# Altium schematic sheet 04 DRIVER.SchDoc: DRIVER
size 420 x 297 mm; SheetNumber: 4; SheetTotal: 6
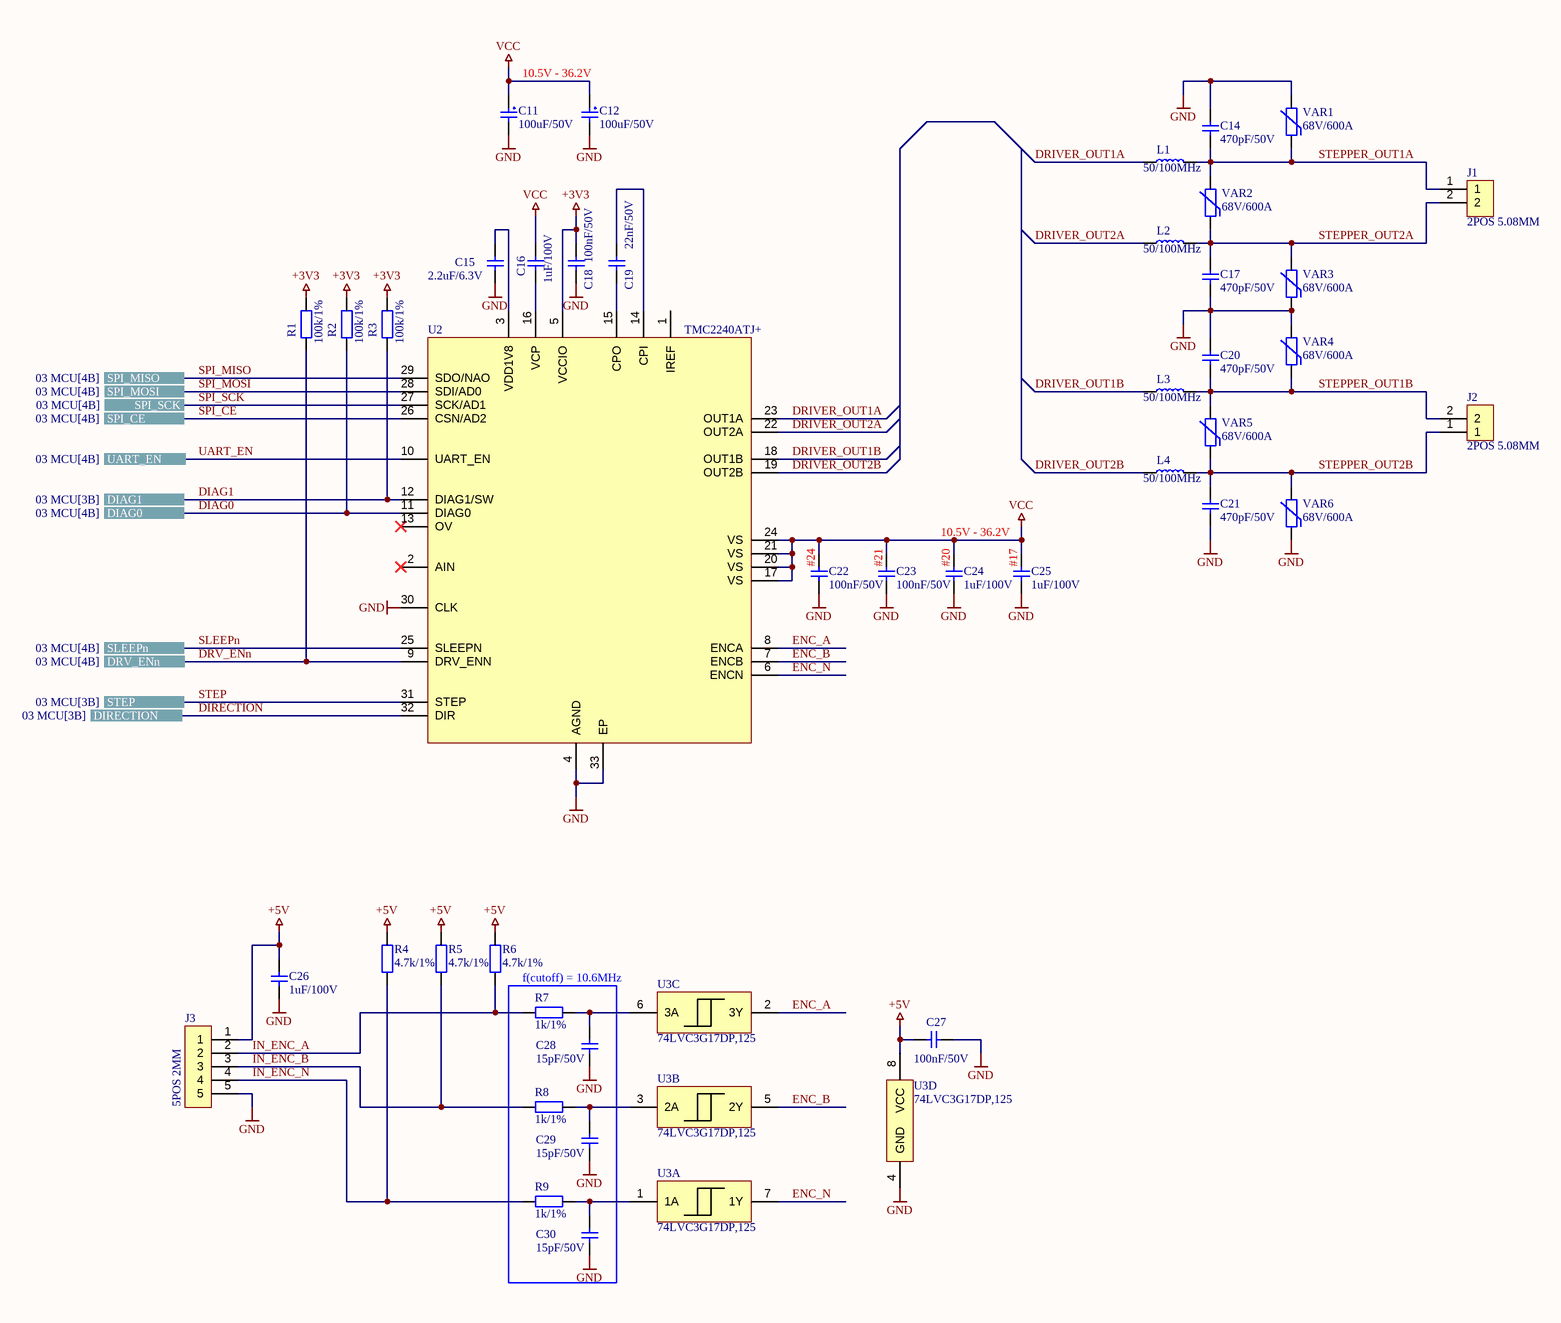
[diagram p0: 04 DRIVER.SchDoc]

## Parts
C11  100uF/50V  [A768KS107M1HLAE030]
C12  100uF/50V  [A768KS107M1HLAE030]
C14  470pF/50V  [CAPC1005X06M-0402]
C15  2.2uF/6.3V  [CAPC1005X06M-0402]
C16  1uF/100V  [CAPC2012X14M]
C17  470pF/50V  [CAPC1005X06M-0402]
C18  100nF/50V  [CAPC1005X06M-0402]
C19  22nF/50V  [CAPC1005X06M-0402]
C20  470pF/50V  [CAPC1005X06M-0402]
C21  470pF/50V  [CAPC1005X06M-0402]
C22  100nF/50V  [CAPC1005X06M-0402]
C23  100nF/50V  [CAPC1005X06M-0402]
C24  1uF/100V  [CAPC2012X14M]
C25  1uF/100V  [CAPC2012X14M]
C26  1uF/100V  [CAPC2012X14M]
C27  100nF/50V  [CAPC1005X06M-0402]
C28  15pF/50V  [CAPC1005X06M-0402]
C29  15pF/50V  [CAPC1005X06M-0402]
C30  15pF/50V  [CAPC1005X06M-0402]
J1  2POS 5.08MM  [282837-2]
J2  2POS 5.08MM  [282837-2]
J3  5POS 2MM  [B5B-PH-K-S]
L1  50/100MHz  [INDC3200X110-1206]
L2  50/100MHz  [INDC3200X110-1206]
L3  50/100MHz  [INDC3200X110-1206]
L4  50/100MHz  [INDC3200X110-1206]
R1  100k/1%  [RESC1005X04M-0402]
R2  100k/1%  [RESC1005X04M-0402]
R3  100k/1%  [RESC1005X04M-0402]
R4  4.7k/1%  [RESC1005X04M-0402]
R5  4.7k/1%  [RESC1005X04M-0402]
R6  4.7k/1%  [RESC1005X04M-0402]
R7  1k/1%  [RESC1005X04M-0402]
R8  1k/1%  [RESC1005X04M-0402]
R9  1k/1%  [RESC1005X04M-0402]
U2  TMC2240ATJ+  [TQFN32-5mmx5mm]
U3  74LVC3G17DP,125  [TSOP65P400X110-8N]  (parts A,B,C,D of 4)
VAR1  68V/600A  [VARA4732X16N]
VAR2  68V/600A  [VARA4732X16N]
VAR3  68V/600A  [VARA4732X16N]
VAR4  68V/600A  [VARA4732X16N]
VAR5  68V/600A  [VARA4732X16N]
VAR6  68V/600A  [VARA4732X16N]

## Blocks framed on the sheet
f(cutoff) = 10.6MHz: C28-C30 R7-R9

## Ports
DIAG0 (see 03 MCU[4B]), DIAG1 (see 03 MCU[3B]), DIRECTION (see 03 MCU[3B]), DRV_ENn (see 03 MCU[4B]), SLEEPn (see 03 MCU[4B]), SPI_CE (see 03 MCU[4B]), SPI_MISO (see 03 MCU[4B]), SPI_MOSI (see 03 MCU[4B]), SPI_SCK (see 03 MCU[4B]), STEP (see 03 MCU[3B]), UART_EN (see 03 MCU[4B])

## Nets
+3V3: C18.2 R1.2 R2.2 R3.2 U2.5(VCCIO)
+5V: C26.2 C27.1 J3.1 R4.2 R5.2 R6.2 U3.8(VCC)
GND: C11.2 C12.2 C14.1 C15.1 C17.2 C18.1 C20.1 C21.2 C22.1 C23.1 C24.1 C25.1 C26.1 C27.2 C28.1 C29.1 C30.1 J3.5 U2.4(AGND) U2.30(CLK) U2.33(EP) U3.4(GND) VAR1.2 VAR3.1 VAR4.2 VAR6.1
VCC: C11.1 C12.1 C16.2 C22.2 C23.2 C24.2 C25.2 U2.17(VS) U2.20(VS) U2.21(VS) U2.24(VS)
DIAG0: R2.1 U2.11(DIAG0) ; port DIAG0
DIAG1: R3.1 U2.12(DIAG1/SW) ; port DIAG1
DIRECTION: U2.32(DIR) ; port DIRECTION
DRIVER_OUT1A: L1.1 U2.23(OUT1A)
DRIVER_OUT1B: L3.1 U2.18(OUT1B)
DRIVER_OUT2A: L2.1 U2.22(OUT2A)
DRIVER_OUT2B: L4.1 U2.19(OUT2B)
DRV_ENn: R1.1 U2.9(DRV_ENN) ; port DRV_ENn
ENC_A: U2.8(ENCA) U3.2(3Y)
ENC_B: U2.7(ENCB) U3.5(2Y)
ENC_N: U2.6(ENCN) U3.7(1Y)
IN_ENC_A: J3.2 R6.1 R7.1
IN_ENC_B: J3.3 R5.1 R8.1
IN_ENC_N: J3.4 R4.1 R9.1
SLEEPn: U2.25(SLEEPN) ; port SLEEPn
SPI_CE: U2.26(CSN/AD2) ; port SPI_CE
SPI_MISO: U2.29(SDO/NAO) ; port SPI_MISO
SPI_MOSI: U2.28(SDI/AD0) ; port SPI_MOSI
SPI_SCK: U2.27(SCK/AD1) ; port SPI_SCK
STEP: U2.31(STEP) ; port STEP
STEPPER_OUT1A: C14.2 J1.1 L1.2 VAR1.1 VAR2.2
STEPPER_OUT1B: C20.2 J2.2 L3.2 VAR4.1 VAR5.2
STEPPER_OUT2A: C17.1 J1.2 L2.2 VAR2.1 VAR3.2
STEPPER_OUT2B: C21.1 J2.1 L4.2 VAR5.1 VAR6.2
UART_EN: U2.10(UART_EN) ; port UART_EN
NetC15_2: C15.2 U2.3(VDD1V8)
NetC16_1: C16.1 U2.16(VCP)
NetC19_1: C19.1 U2.15(CPO)
NetC19_2: C19.2 U2.14(CPI)
NetC28_2: C28.2 R7.2 U3.6(3A)
NetC29_2: C29.2 R8.2 U3.3(2A)
NetC30_2: C30.2 R9.2 U3.1(1A)

Not connected (* = marked no-connect by the designer): U2 1(IREF) 2(AIN)* 13(OV)*

## Notes on the sheet
- 10.5V - 36.2V
- (near C22) #24
- (near C23) #21
- (near C24) #20
- (near C25) #17
- Title
- Project
- Size
- Date
- Revision
- A3
- Designed By

## Library data of the parts
C11 C12 = A768KS107M1HLAE030: 100 µF 50 V Aluminum - Polymer Capacitors Radial, Can - SMD 30mOhm 2000 Hrs @ 125°C; ComponentLink1Description: Datasheet; ComponentLink1URL: https://connect.kemet.com:7667/gateway/IntelliData-ComponentDocumentation/1.0/download/datasheet/A768KS107M1HLAE030; MPN: A768KS107M1HLAE030
C14 C17 C20 C21 = GRM155R71H471KA01D: 470 pF ±10% 50V Ceramic Capacitor X7R 0402 (1005 Metric); ComponentLink1Description: Datasheet; ComponentLink1URL: https://search.murata.co.jp/Ceramy/image/img/A01X/G101/ENG/GRM155R60J475ME47-01.pdf; MPN: GRM155R71H471KA01D
C15 = GRM155C80J225KE95D: 2.2 µF ±10% 6.3V Ceramic Capacitor X6S 0402 (1005 Metric); ComponentLink1Description: Datasheet; ComponentLink1URL: https://search.murata.co.jp/Ceramy/image/img/A01X/G101/ENG/GRM155R60J475ME47-01.pdf; MPN: GRM155C80J225KE95D
C16 C24-C26 = GRM21BC72A105KE01L: 1 µF ±10% 100V Ceramic Capacitor X7S 0805 (2012 Metric); ComponentLink1Description: Datasheet; ComponentLink1URL: https://search.murata.co.jp/Ceramy/image/img/A01X/G101/ENG/GRM21BC72A105KE01-01.pdf; MPN: GRM21BC72A105KE01L
C18 C22 C23 C27 = GRM155R71H104KE14D: 0.1 µF ±10% 50V Ceramic Capacitor X7R 0402 (1005 Metric); ComponentLink1Description: Datasheet; ComponentLink1URL: https://search.murata.co.jp/Ceramy/image/img/A01X/G101/ENG/GRM155R60J475ME47-01.pdf; MPN: GRM155R71H104KE14D
C19 = GRM155R71H223KA12D: 0.022 µF ±10% 50V Ceramic Capacitor X7R 0402 (1005 Metric); ComponentLink1Description: Datasheet; ComponentLink1URL: https://search.murata.co.jp/Ceramy/image/img/A01X/G101/ENG/GRM155R60J475ME47-01.pdf; MPN: GRM155R71H223KA12D
C28-C30 = GRM1555C1H150JA01D: 15 pF ±5% 50V Ceramic Capacitor C0G, NP0 0402 (1005 Metric); ComponentLink1Description: Datasheet; ComponentLink1URL: https://search.murata.co.jp/Ceramy/image/img/A01X/G101/ENG/GRM155R60J475ME47-01.pdf; MPN: GRM1555C1H150JA01D
J1 J2 = 282837-2: MPN: 282834-3; ComponentLink1Description: Datasheet; ComponentLink1URL: https://www.te.com/commerce/DocumentDelivery/DDEController?Action=srchrtrv&DocNm=282834&DocType=Customer+Drawing&DocLang=English
J3 = B5B-PH-K-S: Connector Header Through Hole 5 position 0.079" (2.00mm); ComponentLink1Description: Datasheet; ComponentLink1URL: https://www.jst-mfg.com/product/pdf/eng/ePH.pdf; MPN: B5B-PH-K-S
L1-L4 = 742792114: 50 Ohms 1 Signal Line Ferrite Bead 1206 (3216 Metric) 3A 25mOhm; ComponentLink1Description: Datasheet; ComponentLink1URL: https://www.we-online.com/katalog/datasheet/742792114.pdf; MPN: 742792114
R1-R3 = RC0402FR-07100KL: 100 kOhms ±1% 0.063W, 1/16W Chip Resistor 0402 (1005 Metric) Moisture Resistant Thick Film; ComponentLink1Description: Datasheet; ComponentLink1URL: https://www.yageo.com/upload/media/product/productsearch/datasheet/rchip/PYu-RC_Group_51_RoHS_L_12.pdf; MPN: RC0402FR-07100KL
R4-R6 = RC0402FR-074K7L: 4.7 kOhms ±1% 0.063W, 1/16W Chip Resistor 0402 (1005 Metric) Moisture Resistant Thick Film; ComponentLink1Description: Datasheet; ComponentLink1URL: https://www.yageo.com/upload/media/product/productsearch/datasheet/rchip/PYu-RC_Group_51_RoHS_L_12.pdf; MPN: RC0402FR-074K7L
R7-R9 = RC0402FR-071KL: 1 kOhms ±1% 0.063W, 1/16W Chip Resistor 0402 (1005 Metric) Moisture Resistant Thick Film; ComponentLink1Description: Datasheet; ComponentLink1URL: https://www.yageo.com/upload/media/product/productsearch/datasheet/rchip/PYu-RC_Group_51_RoHS_L_12.pdf; MPN: RC0402FR-071KL
U2 = TMC2240ATJ+: Bipolar Motor Driver Power MOSFET SPI, UART 32-TQFN-EP (5x5); MPN: TMC2240ATJ+; ComponentLink1Description: Datasheet; ComponentLink1URL: http://mm.digikey.com/Volume0/opasdata/d220001/medias/docus/5344/TMC2240.pdf
U3 = 74LVC3G17DP,125: Buffer, Non-Inverting 3 Element 1 Bit per Element Push-Pull Output 8-TSSOP; ComponentLink1Description: Datasheet; ComponentLink1URL: https://assets.nexperia.com/documents/data-sheet/74LVC3G17.pdf; MPN: 74LVC3G17DP,125
VAR1-VAR6 = ZV40K1812601NIR1: 68 V 600 A Varistor 1 Circuit Surface Mount, MLCV 1812 (4532 Metric); ComponentLink1Description: Datasheet; ComponentLink1URL: https://www.bourns.com/docs/Product-Datasheets/ZV_series.pdf; MPN: ZV40K1812601NIR1